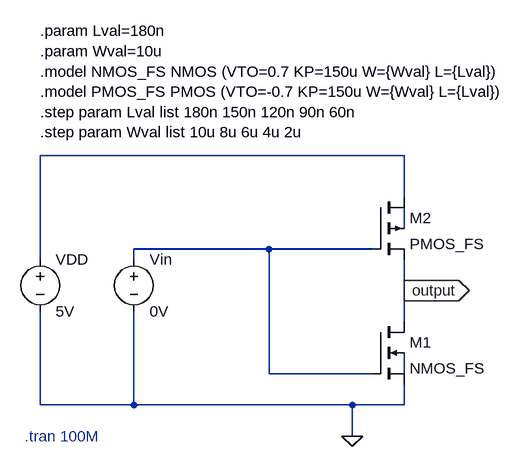
[diagram p0: schematic FS_draft.asc]
FS_draft.asc, the LTspice schematic file:
Version 4
SHEET 1 880 872
WIRE 288 352 -272 352
WIRE 288 416 288 352
WIRE 288 464 288 432
WIRE 80 496 -128 496
WIRE 240 496 80 496
WIRE -272 512 -272 352
WIRE -128 512 -128 496
WIRE 288 560 288 512
WIRE 288 608 288 560
WIRE 80 688 80 496
WIRE 240 688 80 688
WIRE 288 688 288 656
WIRE -272 736 -272 592
WIRE -128 736 -128 592
WIRE -128 736 -272 736
WIRE 208 736 -128 736
WIRE 288 736 288 704
WIRE 288 736 208 736
WIRE 208 784 208 736
FLAG 208 784 0
FLAG 288 560 output
IOPIN 288 560 Out
SYMBOL voltage -272 496 R0
SYMATTR InstName VDD
SYMATTR Value 5V
SYMBOL voltage -128 496 R0
WINDOW 123 0 0 Left 0
WINDOW 39 0 0 Left 0
SYMATTR InstName Vin
SYMATTR Value 0V
SYMBOL nmos4 240 608 R0
SYMATTR InstName M1
SYMATTR Value NMOS_FS
SYMBOL pmos4 240 416 R0
SYMATTR InstName M2
SYMATTR Value PMOS_FS
TEXT -272 160 Left 2 !.param Lval=180n\n.param Wval=10u\n.model NMOS_FS NMOS (VTO=0.7 KP=150u W={Wval} L={Lval})\n.model PMOS_FS PMOS (VTO=-0.7 KP=150u W={Wval} L={Lval})\n.step param Lval list 180n 150n 120n 90n 60n\n.step param Wval list 10u 8u 6u 4u 2u
TEXT -296 784 Left 2 ;.tran 100M

The netlist it stands for:
* FS_draft.asc
VDD N001 0 5V
Vin N003 0 0V
M1 output N003 0 N004 NMOS_FS
M2 N001 N003 output N002 PMOS_FS
.model NMOS NMOS
.model PMOS PMOS
.lib standard.mos
.param Lval=180n
.param Wval=10u
.model NMOS_FS NMOS (VTO=0.7 KP=150u W={Wval} L={Lval})
.model PMOS_FS PMOS (VTO=-0.7 KP=150u W={Wval} L={Lval})
.step param Lval list 180n 150n 120n 90n 60n
.step param Wval list 10u 8u 6u 4u 2u
* .tran 100M
.backanno
.end